# Altium project IsoJTAG.PrjPcb
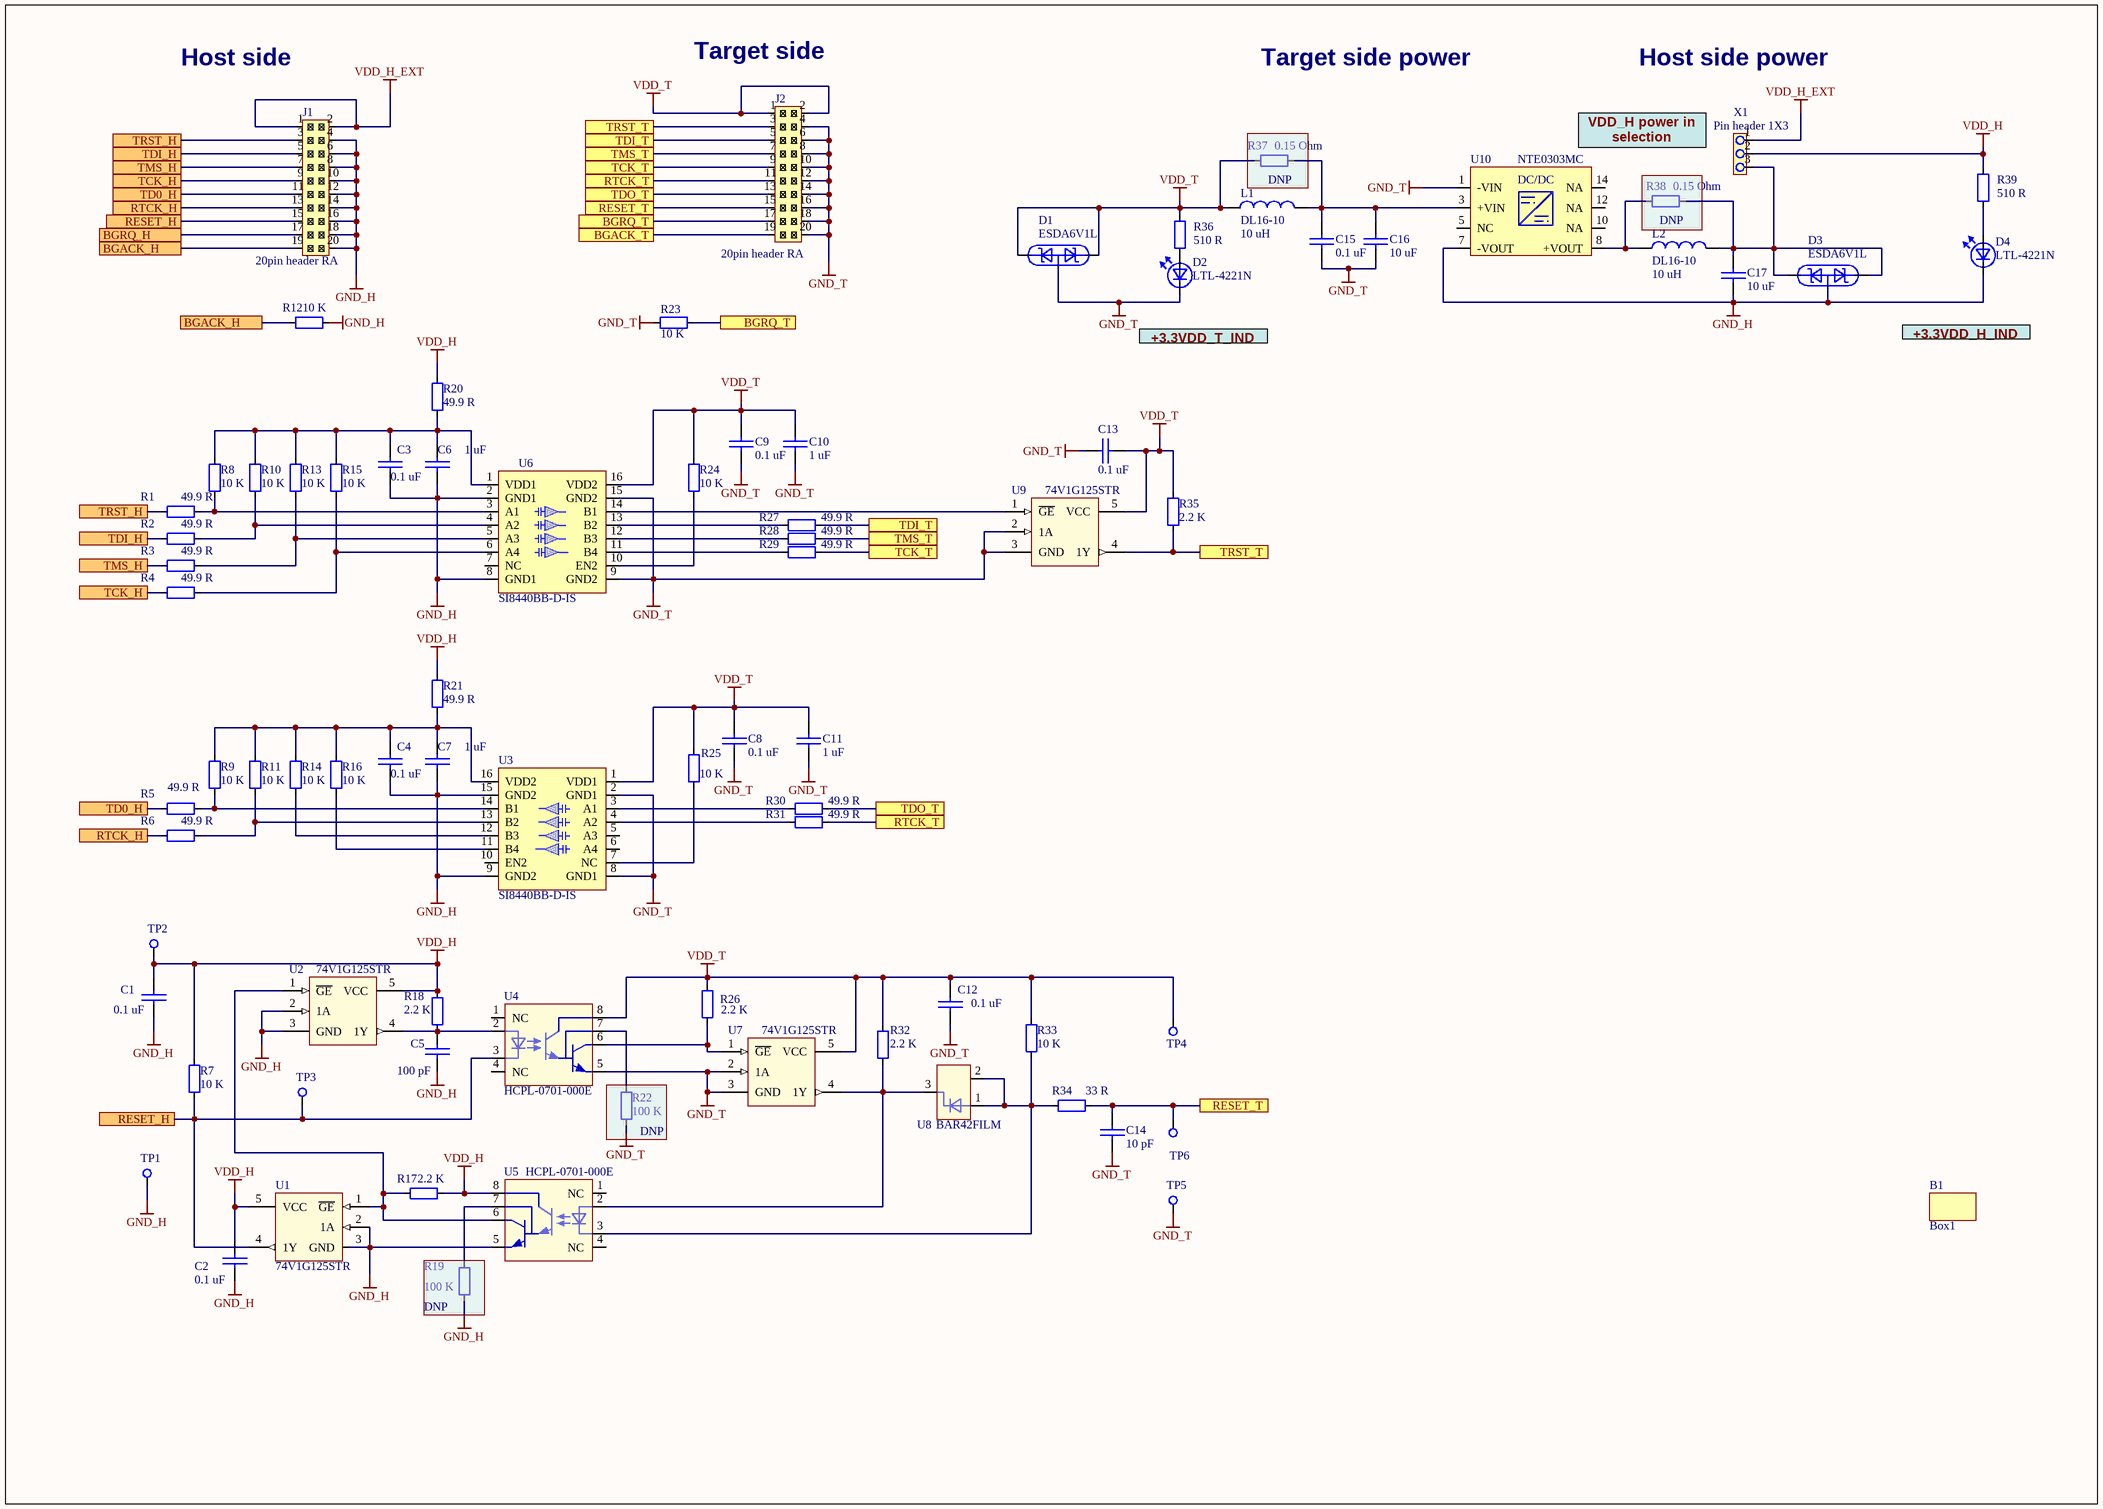
[diagram p0: IsoJTAG.SchDoc]
ProductNumber: JTAG_isolation_board; ProjectAuthor: BARDUVA UAB; ProjectVersion: 2013.06.13; Sheets: 1
1 sheet, 82 parts. Net scope: flat (ports and power ports of the same name join across sheets).
Board file: IsoJTAG.PcbDoc

## Sheet IsoJTAG.SchDoc
size A3; SheetNumber: 1; PageSetup: Record=PageOptions|CenterHorizontal=True|CenterVertical=True|PrintScale=1.00|XCorrection=1.00|YCorrection=1.00|PrintKind=1|BorderSize=5000000|LeftOffset=0|BottomOffset=0|Orientation=2|PaperLength=4200|PaperWidth=2970|Scale=100|PaperSource=256|PrintQuality=600|MediaType=0|DitherType=0|PaperKind=A3|PrintScaleMode=1

### Parts
B1  Box1
C1  0.1 uF  [2012[0805]]
C2  0.1 uF  [2012[0805]]
C3  0.1 uF  [2012[0805]]
C4  0.1 uF  [2012[0805]]
C5  100 pF  [1608[0603]]
C6  1 uF  [2012[0805]]
C7  1 uF  [2012[0805]]
C8  0.1 uF  [2012[0805]]
C9  0.1 uF  [2012[0805]]
C10  1 uF  [2012[0805]]
C11  1 uF  [2012[0805]]
C12  0.1 uF  [2012[0805]]
C13  0.1 uF  [2012[0805]]
C14  10 pF  [1608[0603]]
C15  0.1 uF  [2012[0805]]
C16  10 uF  [2012[0805]]
C17  10 uF  [2012[0805]]
D1  ESDA6V1L  [SOT23]
D2  LTL-4221N  [LED 3 mm]
D3  ESDA6V1L  [SOT23]
D4  LTL-4221N  [LED 3 mm]
J1  20pin header RA  [918520x323]
J2  20pin header RA  [918520x323]
L1  DL16-10  value 10 uH  [DL16-10]
L2  DL16-10  value 10 uH  [DL16-10]
R1  49.9 R  [0603]
R2  49.9 R  [0603]
R3  49.9 R  [0603]
R4  49.9 R  [0603]
R5  49.9 R  [0603]
R6  49.9 R  [0603]
R7  10 K  [0603]
R8  10 K  [0603]
R9  10 K  [0603]
R10  10 K  [0603]
R11  10 K  [0603]
R12  10 K  [0603]
R13  10 K  [0603]
R14  10 K  [0603]
R15  10 K  [0603]
R16  10 K  [0603]
R17  2.2 K  [0603]
R18  2.2 K  [0603]
R19  100 K  [0603]  (no BOM)
R20  49.9 R  [0603]
R21  49.9 R  [0603]
R22  100 K  [0603]  (no BOM)
R23  10 K  [0603]
R24  10 K  [0603]
R25  10 K  [0603]
R26  2.2 K  [0603]
R27  49.9 R  [0603]
R28  49.9 R  [0603]
R29  49.9 R  [0603]
R30  49.9 R  [0603]
R31  49.9 R  [0603]
R32  2.2 K  [0603]
R33  10 K  [0603]
R34  33 R  [0603]
R35  2.2 K  [0603]
R36  value 510 R  [0603]  (hidden comment: RL0603E510-1)
R37  value 0.15 Ohm  [3216[1206]]  (hidden comment: ERJ-8RSFR15V)  (no BOM)
R38  value 0.15 Ohm  [3216[1206]]  (hidden comment: ERJ-8RSFR15V)  (no BOM)
R39  value 510 R  [0603]  (hidden comment: RL0603E510-1)
TP1  TP 0.4-0.8  [TP 0.4-0.8]  (value not drawn)  (no BOM)
TP2  TP 0.4-0.8  [TP 0.4-0.8]  (value not drawn)  (no BOM)
TP3  TP 0.4-0.8  [TP 0.4-0.8]  (value not drawn)  (no BOM)
TP4  TP 0.4-0.8  [TP 0.4-0.8]  (value not drawn)  (no BOM)
TP5  TP 0.4-0.8  [TP 0.4-0.8]  (value not drawn)  (no BOM)
TP6  TP 0.4-0.8  [TP 0.4-0.8]  (value not drawn)  (no BOM)
U1  74V1G125STR  [SOT23-5L]
U2  74V1G125STR  [SOT23-5L]
U3  SI8440BB-D-IS  [SO-G16/D10.4]
U4  HCPL-0701-000E  [SO-8]
U5  HCPL-0701-000E  [SO-8]
U6  SI8440BB-D-IS  [SO-G16/D10.4]
U7  74V1G125STR  [SOT23-5L]
U8  BAR42FILM  [SOT23]
U9  74V1G125STR  [SOT23-5L]
U10  NTE0303MC  [NTE DC_DC]
X1  Pin header 1X3  [HDR1X3]

### Blocks framed on the sheet
DNP: R37
DNP: R38
DNP: R22
DNP: R19

### Ports
BGACK_H, BGACK_T, BGRQ_H, BGRQ_T, RESET_H, RESET_T, RTCK_H, RTCK_T, TCK_H, TCK_T, TD0_H, TDI_H, TDI_T, TDO_T, TMS_H, TMS_T, TRST_H, TRST_T

### Nets
GND_H: C1.2 C2.2 C3.1 C4.1 C5.2 C6.2 C7.2 C17.2 D3.3 D4.1(C) J1.4 J1.6 J1.8 J1.10 J1.12 J1.14 J1.16 J1.18 J1.20 R12.1 R19.2 TP1.1 U1.2(1A) U1.3(GND) U2.2(1A) U2.3(GND) U3.9(GND2) U3.15(GND2) U5.5(C) U6.2(GND1) U6.8(GND1) U10.7(-VOUT)
GND_T: C8.1 C9.1 C10.2 C11.2 C12.2 C13.1 C14.2 C15.1 C16.1 D1.3 D2.1(C) J2.4 J2.6 J2.8 J2.10 J2.12 J2.14 J2.16 J2.18 J2.20 R22.1 R23.1 TP5.1 U3.2(GND1) U3.8(GND1) U4.5(C) U6.9(GND2) U6.15(GND2) U7.2(1A) U7.3(GND) U9.2(1A) U9.3(GND) U10.1(-VIN)
VDD_H: C1.1 C2.1 R7.2 R17.1 R18.2 R20.1 R21.1 R39.2 TP2.1 U1.5(VCC) U2.5(VCC) U5.8(C) X1.2
VDD_H_EXT: J1.1 J1.2 X1.1
VDD_T: C8.2 C9.2 C10.1 C11.1 C12.1 C13.2 D1.1 D1.2 J2.1 J2.2 L1.1 R24.1 R25.1 R26.2 R32.2 R33.2 R35.2 R36.2 R37.2 TP4.1 U3.1(VDD1) U4.8(C) U6.16(VDD2) U7.5(VCC) U9.5(VCC)
NetC3_2: C3.2 C6.1 R8.2 R10.2 R13.2 R15.2 R20.2 U6.1(VDD1)
NetC4_2: C4.2 C7.1 R9.2 R11.2 R14.2 R16.2 R21.2 U3.16(VDD2)
NetC5_1: C5.1 R18.1 U2.4(1Y) U4.2(C)
NetC14_1: C14.1 J2.15 R34.1 TP6.1 ; port RESET_T
NetC15_2: C15.2 C16.2 L1.2 R37.1 U10.3(+VIN)
NetC17_1: C17.1 D3.1 D3.2 L2.2 R38.1 X1.3
NetD2_2: D2.2(A) R36.1
NetD4_2: D4.2(A) R39.1
NetJ1_3: J1.3 R1.2 ; port TRST_H
NetJ1_5: J1.5 R2.2 ; port TDI_H
NetJ1_7: J1.7 R3.2 ; port TMS_H
NetJ1_9: J1.9 R4.2 ; port TCK_H
NetJ1_11: J1.11 R5.2 ; port TD0_H
NetJ1_13: J1.13 R6.2 ; port RTCK_H
NetJ1_15: J1.15 R7.1 TP3.1 U1.4(1Y) U4.3(C) ; port RESET_H
NetJ1_17: J1.17 ; port BGRQ_H
NetJ1_19: J1.19 R12.2 ; port BGACK_H
NetJ2_3: J2.3 R35.1 U9.4(1Y) ; port TRST_T
NetJ2_5: J2.5 R27.1 ; port TDI_T
NetJ2_7: J2.7 R28.1 ; port TMS_T
NetJ2_9: J2.9 R29.1 ; port TCK_T
NetJ2_11: J2.11 R31.1 ; port RTCK_T
NetJ2_13: J2.13 R30.1 ; port TDO_T
NetJ2_17: J2.17 R23.2 ; port BGRQ_T
NetJ2_19: J2.19 ; port BGACK_T
NetL2_1: L2.1 R38.2 U10.8(+VOUT)
NetR1_1: R1.1 R8.1 U6.3(A1)
NetR2_1: R2.1 R10.1 U6.4(A2)
NetR3_1: R3.1 R13.1 U6.5(A3)
NetR4_1: R4.1 R15.1 U6.6(A4)
NetR5_1: R5.1 R9.1 U3.14(B1)
NetR6_1: R6.1 R11.1 U3.13(B2)
NetR14_1: R14.1 U3.12(B3)
NetR16_1: R16.1 U3.11(B4)
NetR17_2: R17.2 U1.1(~{GE}) U2.1(~{GE}) U5.6(C)
NetR19_1: R19.1 U5.7(C)
NetR22_2: R22.2 U4.7(C)
NetR24_2: R24.2 U6.10(EN2)
NetR25_2: R25.2 U3.7(NC)
NetR26_1: R26.1 U4.6(C) U7.1(~{GE})
NetR27_2: R27.2 U6.13(B2)
NetR28_2: R28.2 U6.12(B3)
NetR29_2: R29.2 U6.11(B4)
NetR30_2: R30.2 U3.3(A1)
NetR31_2: R31.2 U3.4(A2)
NetR32_1: R32.1 U5.2(C) U7.4(1Y) U8.3(K)
NetR33_1: R33.1 R34.2 U5.3(C) U8.1(A) U8.2(NC)
NetU6_14: U6.14(B1) U9.1(~{GE})

Not connected (* = marked no-connect by the designer): U3 5(A3) 6(A4) 10(EN2); U4 1(NC) 4(NC); U5 1(NC) 4(NC); U6 7(NC); U10 5(NC) 10(NA) 12(NA) 14(NA)

### Notes on the sheet
- Host side
- (near J2) Target side
- Target side power
- Host side power
- VDD_H power in selection
- (near D2) +3.3VDD_T_IND
- +3.3VDD_H_IND
- (in symbol NTE0303MC DC/DC) DC/DC

### Library data of the parts
B1 = HA1593KBK box: Enclosure: multipurpose; 1593; X:66mm; Y:66mm; Z:28mm; ABS; black; Manufacturer: HAMMOND; Tolerance: 20%; Value: 10 uH; Distributor: TME; Price: 0.792; PartNum: HA1593KBK; Link: http://www.tme.eu/lt/details/hm-1593kbk/korpusai-su-skydeliais/hammond/1593kbk/#
C1-C4 C8 C9 C12 C13 C15 = 0805, 0.1 uF, 50 V, X7R: 0.1 uF, X7R,  0805; Manufacturer: Kemet; Voltage: 50 V; Tolerance: +-10%; Value: 0.1 uF
C5 = CCPF100K0603: 100 pF, 50V, 5%, NP0, 0603 SMD MLC Capacitor; Manufacturer: Darfon; Voltage: 50 V; Tolerance: 5%; Distributor: Schukat; PartNum: CCPF100K0603; Price: 0.005 Euro; Value: 100 pF
C6 C7 C10 C11 = CVUF001K0805: 1 uF, 16V, 10%, X7R, 0805; Manufacturer: Kemet, Rohm, Darfon; Voltage: 16 V; Tolerance: 10%; Distributor: Schukat; PartNum: CVUF001K0805; Price: 0.023 Euro; Value: 1 uF
C14 = CCPF010K0603: 10 pF, 50V, 5%, NP0, 0603 SMD MLC Capacitor; Manufacturer: Darfon; Voltage: 50 V; Tolerance: 5%; Distributor: Schukat; PartNum: CCPF010K0603; Price: 0.005 Euro; Value: 10 pF
C16 C17 = GRM21BR61A106KE19L: 10 uF, 10V, X5R, 10%, 0805,  -55°C..85°C; Manufacturer: Murata; PartNum: 490-1709-1-ND; Voltage: 10V; Tolerance: 10%; Distributor: Digi-Key; Price: 0.193$; Value: 10 uF
D1 D3 = ESDA6V1L: Dual transil array for ESD, 6.1 V, 300 W; Manufacturer: Micro Commercial Co; PartNum: ESDA6V1L-TPCT-ND; PartName: ESDA6V1L-TP; Distributor: Digi-Key; Price: 0.23$
D2 D4 = LTL-4221N: LED 3 mm
J1 J2 = 2-1634689-0 20pin header: Socket; IDC; male; PIN:20; angled; THT; 1.27mm; Pitch:2.54mm; Manufacturer: Harting; PartName: 09185206323; Distributor: TE; PartNum: 2-1634689-0; Price: 4.47; Link: http://lt.farnell.com/te-connectivity-amp/2-1634689-0/header-box-right-angle-20way/dp/8396027
L1 L2 = DL16-10 10uH: Inductor: wire; 10uH; Ioper:1.1A; 0.16R; SMD; Isat:1.1A; B:4.45mm; Manufacturer: FERROCORE; Tolerance: 20%; Distributor: TME; Price: 0.792; PartNum: DL16-10; Link: http://www.tme.eu/lt/details/dl16-10/smd-galios-droseliai/ferrocore/#
R1-R6 R20 R21 R27-R31 = CRCW060349R9FKEA: 49.9 R, 1%, 0.1 W, 0603, SMD Resistor, Taped; Manufacturer: Vishay/Dale; PartNum: 541-49.9HTR-ND; Voltage: 75 V; Distributor: DigiKey; Price: 0.006 $; Tolerance: 1%; Value: 49.9 R
R7-R16 R23-R25 R33 = RL0603K010-1: 10 K, 1%, 0603, SMD Resistor, Taped; Manufacturer: Vishay; Voltage: 75 V; Distributor: Schukat; Price: 0.002 Euro; Tolerance: 1%; Value: 10 K; PartNum: RL0603K010-1
R17 R18 R26 R32 R35 = RL0603K002.2-1: 2.2 K, 1%, 0603, SMD Resistor, Taped; Manufacturer: Vishay; Voltage: 75 V; Distributor: Schukat; Price: 0.002 Euro; Tolerance: 1%; Value: 2.2 K; PartNum: RL0603K002.2-1
R19 R22 = RL0603K100-1: 100 K, 1%, 0603, SMD Resistor, Taped; Manufacturer: Vishay; Voltage: 75 V; Distributor: Schukat; Price: 0.002 Euro; Tolerance: 1%; Value: 100 K; PartNum: RL0603K100-1
R34 = RL0603E033-1: 33 R, 1%, 0603, SMD Resistor, Taped; Manufacturer: Vishay; Voltage: 75 V; Distributor: Schukat; Price: 0.002 Euro; Tolerance: 1%; Value: 33 R; PartNum: RL0603E033-1
R36 R39 = RL0603E510-1: 510 R, 1%, 0603, SMD Resistor, Taped; Manufacturer: Vishay; Voltage: 75 V; Distributor: Schukat; Price: 0.002 Euro; Tolerance: 1%; PartNum: RL0603E510-1; PartName: RL0603E510-1
R37 R38 = ERJ-8RSFR15V: 0.15 Ohm, 0.25 W, 1% 1206; Manufacturer: Panasonic; Tolerance: 1%
U1 U2 U7 U9 = 74V1G125STR buffer: Single Bus Buffer (3-State), Non Inverting, 2-5.5V, SOT-23-5, -55-125C,; Manufacturer: ST; Distributor: Farnell; PartNum: 74V1G125STR; Price: 2.21; Link: http://lt.farnell.com/stmicroelectronics/74v1g125str/ic-74v-smd/dp/1467727
U3 U6 = SI8440AB-D-IS: IC ISOLATOR 4CH 5.5V 16-SOIC; Manufacturer: Silicon Laboratories Inc; PartNum: 336-1760-5-ND; Assembly Variant: Base; Boards Count: 1; Distributor: Digi-Key; Price: 2.5$; PartName: SI8440BB-D-IS; Check data: 2011.06.28
U4 U5 = HCPL-0701-000E: OPTOCOUPLER, SMD, TRANSISTOR O/P; Manufacturer: Avago; Price: 8.02; Distributor: Farnell; PartNum: HCPL-0701-000E; Link: http://lt.farnell.com/avago-technologies/hcpl-0701-000e/optocoupler-smd-darlington-o-p/dp/9995200
U8 = BAR42FILM: Schottky Single 30V, 100 mA, 400mV, SOT-23, Marking D94; Manufacturer: ST; Distributor: Farnell; PartNum: BAR42FILM; Price: 0.283; Link: http://lt.farnell.com/stmicroelectronics/bar42film/diode-schottky-sot-23/dp/9801359RL#similarProducts
U10 = NTE0303MC DC/DC: CONVERTER, DC/DC, SMD, 1W, 3.3V,  12,7x6.6x7.7mm, 1kV isol; Manufacturer: MURATA; Price: 24.93; Distributor: Farnell; PartNum: NTE0303MC; Link: http://lt.farnell.com/murata-power-solutions/nte0303mc/converter-dc-dc-smd-1w-3-3v/dp/1610436?ref=lookahead